# Altium schematic sheet Connectors.SchDoc
size 209 x 297 mm; SheetNumber: 3; SheetTotal: 6; Разработчик: Волков; Проверяющий: Андрейчук; Технический_контроль: Ашуркевич; Нормативный_контроль: Василевская; Утвердил: Чвала; Номер_листа: 1; Количество_листов: 4; Организация: МРК; Номер_документа: ТЗСЦ.421457.001Э3; Название_документа: Устройство управления сервоприводами на основе микроконтроллера STM32
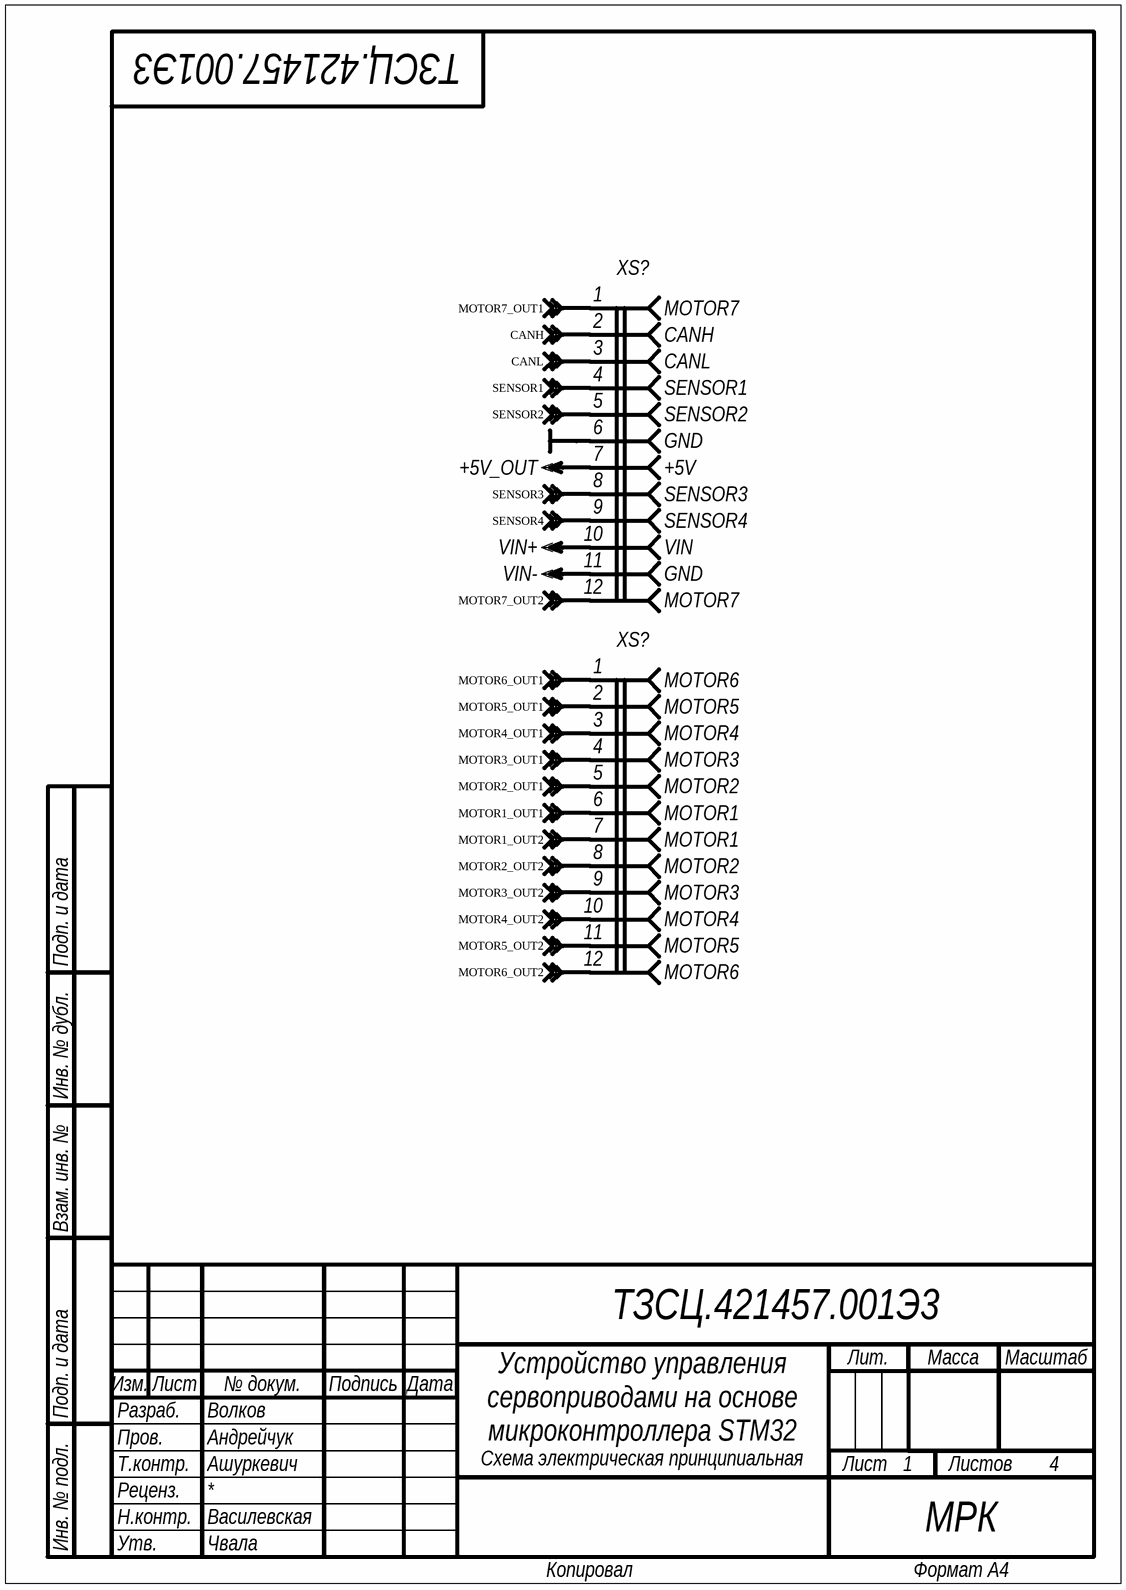
[diagram p0: Connectors.SchDoc]

## Parts
(Parts that share a designator on the sheet are numbered #1, #2 ... from top to bottom, then left to right.)
XS?#1  Connector_Left  (value not drawn)
XS?#2  Connector_Right  (value not drawn)

## Nets
+5V_OUT: XS?#1.7(+5V)
GND: XS?#1.6(GND)
VIN+: XS?#1.10(VIN)
VIN-: XS?#1.11(GND)
CANH: XS?#1.2(CANH) ; off-sheet CANH
CANL: XS?#1.3(CANL) ; off-sheet CANL
MOTOR1_OUT1: XS?#2.6(MOTOR1) ; off-sheet MOTOR1_OUT1
MOTOR1_OUT2: XS?#2.7(MOTOR1) ; off-sheet MOTOR1_OUT2
MOTOR2_OUT1: XS?#2.5(MOTOR2) ; off-sheet MOTOR2_OUT1
MOTOR2_OUT2: XS?#2.8(MOTOR2) ; off-sheet MOTOR2_OUT2
MOTOR3_OUT1: XS?#2.4(MOTOR3) ; off-sheet MOTOR3_OUT1
MOTOR3_OUT2: XS?#2.9(MOTOR3) ; off-sheet MOTOR3_OUT2
MOTOR4_OUT1: XS?#2.3(MOTOR4) ; off-sheet MOTOR4_OUT1
MOTOR4_OUT2: XS?#2.10(MOTOR4) ; off-sheet MOTOR4_OUT2
MOTOR5_OUT1: XS?#2.2(MOTOR5) ; off-sheet MOTOR5_OUT1
MOTOR5_OUT2: XS?#2.11(MOTOR5) ; off-sheet MOTOR5_OUT2
MOTOR6_OUT1: XS?#2.1(MOTOR6) ; off-sheet MOTOR6_OUT1
MOTOR6_OUT2: XS?#2.12(MOTOR6) ; off-sheet MOTOR6_OUT2
MOTOR7_OUT1: XS?#1.1(MOTOR7) ; off-sheet MOTOR7_OUT1
MOTOR7_OUT2: XS?#1.12(MOTOR7) ; off-sheet MOTOR7_OUT2
SENSOR1: XS?#1.4(SENSOR1) ; off-sheet SENSOR1
SENSOR2: XS?#1.5(SENSOR2) ; off-sheet SENSOR2
SENSOR3: XS?#1.8(SENSOR3) ; off-sheet SENSOR3
SENSOR4: XS?#1.9(SENSOR4) ; off-sheet SENSOR4

## Notes on the sheet
- Подп. и дата
- Инв. № дубл.
- Взам. инв. №
- Разраб.
- Изм.
- Лист
- № докум.
- Подпись
- Дата
- Лит.
- Масса
- Масштаб
- Пров.
- Т.контр.
- Схема электрическая принципиальная
- Листов
- Реценз.
- Н.контр.
- Утв.
- Инв. № подл.
- Копировал
- Формат А4

## Library data of the parts
XS?#1 = Connector_Left: 12 pin
XS?#2 = Connector_Right: 12 pin